# Altium schematic sheet Sheet1.SchDoc
size A3; SheetNumber: 1; SheetTotal: 1
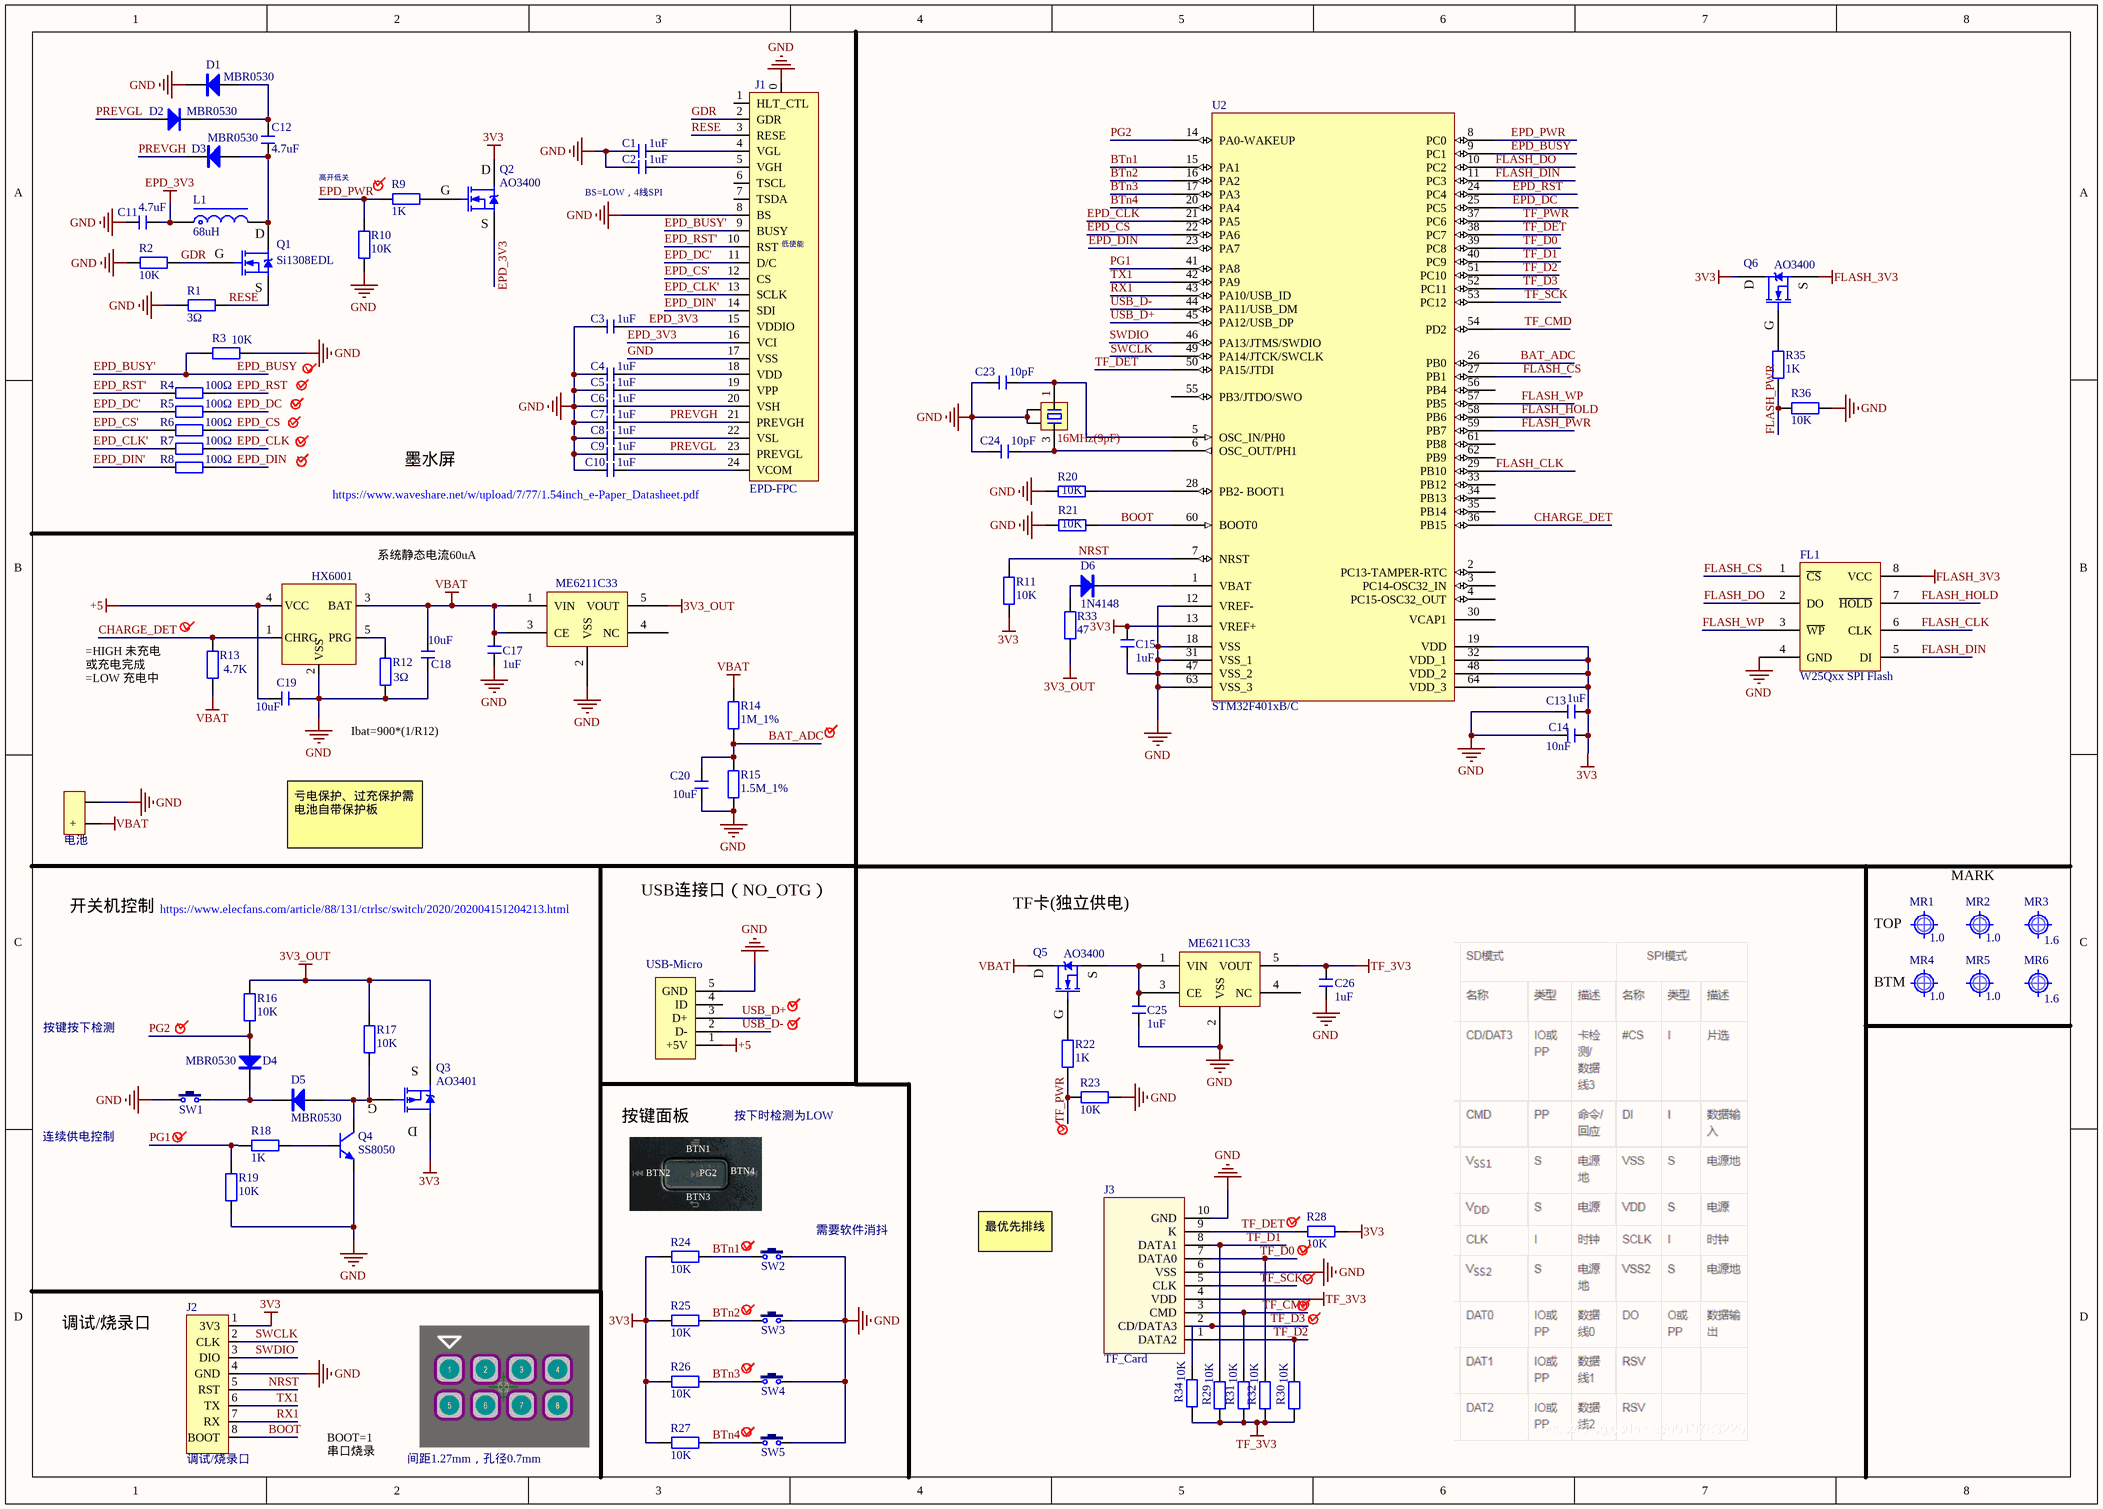
[diagram p0: Sheet1.SchDoc]

## Parts
BAT  电池  [BAT_AC]
C1  1uF  [0603]
C2  1uF  [0603]
C3  1uF  [0603]
C4  1uF  [0603]
C5  1uF  [0603]
C6  1uF  [0603]
C7  1uF  [0603]
C8  1uF  [0603]
C9  1uF  [0603]
C10  1uF  [0603]
C11  4.7uF  [0603]
C12  4.7uF  [0603]
C13  1uF  [0603]
C14  10nF  [0603]
C15  1uF  [0603]
C17  1uF  [0603]
C18  10uF  [0603]
C19  10uF  [0603]
C20  10uF  [0603]
C23  10pF  [0603]
C24  10pF  [0603]
C25  1uF  [0603]
C26  1uF  [0603]
CC1  HX6001  [SOT23-5]
D1  MBR0530  [SOD-123]
D2  MBR0530  [SOD-123]
D3  MBR0530  [SOD-123]
D4  MBR0530  [SOD-123]
D5  MBR0530  [SOD-123]
D6  1N4148  [SOD-123]
FL1  W25Qxx SPI Flash  [SOP8_N]
J1  EPD-FPC  [FPC0.5 2H-WS-24P]
J2  调试/烧录口  [DEBUG_JP]
J3  TF_Card  [Micro SD]
L1  68uH  [0805]
MR1  1.0  [Mark 1]
MR2  1.0  [Mark 1]
MR3  1.6  [Mark 1.6]
MR4  1.0  [Mark 1]
MR5  1.0  [Mark 1]
MR6  1.6  [Mark 1.6]
PD1  ME6211C33  [SOT23-5]
PD2  ME6211C33  [SOT23-5]
Q1  Si1308EDL  [SOT323]
Q2  AO3400  [SOT23]
Q3  AO3401  [SOT23]
Q4  SS8050  [SOT23]
Q5  AO3400  [SOT23]
Q6  AO3400  [SOT23]
R1  3Ω  [0603]
R2  10K  [0603]
R3  10K  [0603]
R4  100Ω  [0603]
R5  100Ω  [0603]
R6  100Ω  [0603]
R7  100Ω  [0603]
R8  100Ω  [0603]
R9  1K  [0603]
R10  10K  [0603]
R11  10K  [0603]
R12  3Ω  [0603]
R13  4.7K  [0603]
R14  1M_1%  [0603]
R15  1.5M_1%  [0603]
R16  10K  [0603]
R17  10K  [0603]
R18  1K  [0603]
R19  10K  [0603]
R20  10K  [0603]
R21  10K  [0603]
R22  1K  [0603]
R23  10K  [0603]
R24  10K  [0603]
R25  10K  [0603]
R26  10K  [0603]
R27  10K  [0603]
R28  10K  [0603]
R29  10K  [0603]
R30  10K  [0603]
R31  10K  [0603]
R32  10K  [0603]
R33  47  [0603]
R34  10K  [0603]
R35  1K  [0603]
R36  10K  [0603]
SW1  3x6x5  [TSW SMD-3*6*2.5]  (value not drawn)
SW2  3x6x5  [TSW SMD-3*6*2.5]  (value not drawn)
SW3  3x6x5  [TSW SMD-3*6*2.5]  (value not drawn)
SW4  3x6x5  [TSW SMD-3*6*2.5]  (value not drawn)
SW5  3x6x5  [TSW SMD-3*6*2.5]  (value not drawn)
U2  STM32F401xB/C  [LQFP64 10x10_N]
USB-Micro  无柱贴片  [USB-MICRO_E]  (value not drawn)
X?  16MHz(9pF)  [OSC 3225-4P]

## Nets
3V3: C13.2 C14.2 C15.1 J2.1(3V3) Q2.2(D) Q3.2(D) Q6.2(D) R11.2 R24.1 R25.1 R26.1 R27.1 R28.1 U2.13(VREF+) U2.19(VDD) U2.32(VDD_1) U2.48(VDD_2) U2.64(VDD_3)
3V3_OUT: PD1.5(VOUT) Q3.3(S) R16.1 R17.2 R33.2
+5: C19.1 CC1.4(VCC) USB-Micro.1(+5V)
EPD_3V3: C3.2 C11.2 J1.15(VDDIO) J1.16(VCI) L1.1 Q2.3(S)
FLASH_3V3: FL1.8(VCC) Q6.3(S)
GND: BAT.2(-) C1.1 C2.1 C3.1 C4.1 C5.1 C6.1 C7.1 C8.1 C9.1 C10.1 C11.1 C13.1 C14.1 C15.2 C17.2 C18.1 C19.2 C20.1 C23.2 C24.2 C25.1 C26.1 CC1.2(VSS) D1.2(K) FL1.4(GND) J1.0 J1.8(BS) J1.17(VSS) J2.4(GND) J3.6(VSS) J3.10(GND) PD1.2(VSS) PD2.2(VSS) Q4.3(E) R1.1 R2.1 R3.2 R10.2 R12.1 R15.2 R19.2 R20.2 R21.1 R23.2 R36.2 SW1.1 SW2.2 SW3.2 SW4.2 SW5.2 U2.12(VREF-) U2.18(VSS) U2.31(VSS_1) U2.47(VSS_2) U2.63(VSS_3) USB-Micro.5(GND) X?.2 X?.4
TF_3V3: C26.2 J3.4(VDD) PD2.5(VOUT) R29.1 R30.1 R31.1 R32.1 R34.1
VBAT: BAT.1(+) C17.1 C18.2 CC1.3(BAT) PD1.1(VIN) PD1.3(CE) Q5.2(D) R13.2 R14.1
BAT_ADC: C20.2 R14.2 R15.1 U2.26(PB0)
BOOT: J2.8(BOOT) R21.2 U2.60(BOOT0)
BTn1: R24.2 SW2.1 U2.15(PA1)
BTn2: R25.2 SW3.1 U2.16(PA2)
BTn3: R26.2 SW4.1 U2.17(PA3)
BTn4: R27.2 SW5.1 U2.20(PA4)
CHARGE_DET: CC1.1(CHRG) R13.1 U2.36(PB15)
EPD_BUSY: J1.9(BUSY) R3.1 U2.9(PC1)  [also labelled EPD_BUSY']
EPD_CLK: R7.2 U2.21(PA5)
EPD_CLK': J1.13(SCLK) R7.1
EPD_CS: R6.2 U2.22(PA6)
EPD_CS': J1.12(CS) R6.1
EPD_DC: R5.2 U2.25(PC5)
EPD_DC': J1.11(D/C) R5.1
EPD_DIN: R8.2 U2.23(PA7)
EPD_DIN': J1.14(SDI) R8.1
EPD_PWR: R9.1 R10.1 U2.8(PC0)
EPD_RST: R4.2 U2.24(PC4)
EPD_RST': J1.10(RST) R4.1
FLASH_CLK: FL1.6(CLK) U2.29(PB10)
FLASH_CS: FL1.1(~{CS}) U2.27(PB1)
FLASH_DIN: FL1.5(DI) U2.11(PC3)
FLASH_DO: FL1.2(DO) U2.10(PC2)
FLASH_HOLD: FL1.7(~{HOLD}) U2.58(PB6)
FLASH_PWR: R35.1 R36.1 U2.59(PB7)
FLASH_WP: FL1.3(~{WP}) U2.57(PB5)
GDR: J1.2(GDR) Q1.2(G) R2.2
NRST: J2.5(RST) R11.1 U2.7(NRST)
PG1: R18.1 R19.1 U2.41(PA8)
PG2: D4.1(A) R16.2 U2.14(PA0-WAKEUP)
PREVGH: C7.2 D3.2(K) J1.21(PREVGH)
PREVGL: C9.2 D2.1(A) J1.23(PREVGL)
RESE: J1.3(RESE) Q1.1(S) R1.2
RX1: J2.7(RX) U2.43(PA10/USB_ID)
SWCLK: J2.2(CLK) U2.49(PA14/JTCK/SWCLK)
SWDIO: J2.3(DIO) U2.46(PA13/JTMS/SWDIO)
TF_CMD: J3.3(CMD) R31.2 U2.54(PD2)
TF_D0: J3.7(DATA0) R32.2 U2.39(PC8)
TF_D1: J3.8(DATA1) R29.2 U2.40(PC9)
TF_D2: J3.1(DATA2) R30.2 U2.51(PC10)
TF_D3: J3.2(CD/DATA3) R34.2 U2.52(PC11)
TF_DET: J3.9(K) R28.2 U2.38(PC7) U2.50(PA15/JTDI)
TF_PWR: R22.1 R23.1 U2.37(PC6)
TF_SCK: J3.5(CLK) U2.53(PC12)
TX1: J2.6(TX) U2.42(PA9)
USB_D+: U2.45(PA12/USB_DP) USB-Micro.3(D+)
USB_D-: U2.44(PA11/USB_DM) USB-Micro.2(D-)
NetC1_2: C1.2 J1.4(VGL)
NetC2_2: C2.2 J1.5(VGH)
NetC4_2: C4.2 J1.18(VDD)
NetC5_2: C5.2 J1.19(VPP)
NetC6_2: C6.2 J1.20(VSH)
NetC8_2: C8.2 J1.22(VSL)
NetC10_2: C10.2 J1.24(VCOM)
NetC12_1: C12.1 D3.1(A) L1.2 Q1.3(D)
NetC12_2: C12.2 D1.1(A) D2.2(K)
NetC23_1: C23.1 U2.5(OSC_IN/PH0) X?.1
NetC24_1: C24.1 U2.6(OSC_OUT/PH1) X?.3
NetC25_2: C25.2 PD2.1(VIN) PD2.3(CE) Q5.3(S)
NetCC1_5: CC1.5(PRG) R12.2
NetD4_2: D4.2(K) D5.2(K) SW1.2
NetD5_1: D5.1(A) Q3.1(G) Q4.2(C) R17.1
NetD6_1: D6.1(A) R33.1
NetD6_2: D6.2(K) U2.1(VBAT)
NetQ2_1: Q2.1(G) R9.2
NetQ4_1: Q4.1(B) R18.2
NetQ5_1: Q5.1(G) R22.2
NetQ6_1: Q6.1(G) R35.2
NetR20_1: R20.1 U2.28(PB2-_BOOT1)

Not connected (* = marked no-connect by the designer): J1 1(HLT_CTL) 6(TSCL) 7(TSDA); PD1 4(NC); PD2 4(NC); U2 2(PC13-TAMPER-RTC) 3(PC14-OSC32_IN) 4(PC15-OSC32_OUT) 30(VCAP1) 33(PB12) 34(PB13) 35(PB14) 55(PB3/JTDO/SWO) 56(PB4) 61(PB8) 62(PB9); USB-Micro 4(ID)

## Notes on the sheet
- 高开低关
- (near C2) BS=LOW，4线SPI
- (near J1) 低使能
- https://www.waveshare.net/w/upload/7/77/1.54inch_e-Paper_Datasheet.pdf
- 墨水屏
- (near CC1) 系统静态电流60uA
- Ibat=900*(1/R12)
- 亏电保护、过充保护需电池自带保护板
- 开关机控制
- https://www.elecfans.com/article/88/131/ctrlsc/switch/2020/202004151204213.html
- USB连接口（NO_OTG）
- (near Q5) TF卡(独立供电)
- MARK
- (near MR1) TOP
- (near MR4) BTM
- 按键按下检测
- 按键面板
- 按下时检测为LOW
- 连续供电控制
- BTN2
- BTN1
- PG2
- BTN4
- BTN3
- (near SW2) 需要软件消抖
- 最优先排线
- 调试/烧录口
- BOOT=1
  串口烧录
- 间距1.27mm，孔径0.7mm

## Library data of the parts
BAT = J_BAT: 电池接口
C1 = C: 无极性贴片电容 50v耐压; 版权归属: 源创客; BOM名称: 无极性贴片电容; 学习资源: www.ooocke.com
C2-C15 C17-C20 C23-C26 = C: 无极性贴片电容; 版权归属: 源创客; BOM名称: 无极性贴片电容; 学习资源: www.ooocke.com
CC1 = HX6001: HX6001(UN8HX)锂电池充电管理IC
D1-D5 = MBR0530: 肖特基二极管; BOM名称: 整流二极管; 版权归属: 源创客; 学习资源: www.ooocke.com
D6 = 1N4148: 开关二极管; BOM名称: 肖特基二极管; 版权归属: 源创客; 属性: 40V/3A; 学习资源: www.ooocke.com
FL1 = W25Qxx: W25Qxx SPI Flash,容量小于128Mbit
J2 = DEBUG_JP
J3 = TF_Card: TF卡座; 版权归属: 源创客; BOM名称: TF卡座; 学习资源: www.ooocke.com
L1 = L-CD: 贴片功率电感; BOM名称: 功率电感; 版权归属: 源创客; 学习资源: www.ooocke.com
MR1-MR6 = MARK: 光学定位点; 版权归属: 源创客; BOM名称: 光学定位点; 学习资源: www.ooocke.com
PD1 PD2 = ME6211C33: ME6211C33 3.3v线性LDO
Q1 = Si1308EDL: N沟道场效应管; 版权归属: 源创客; BOM名称: N沟道场效应管; 学习资源: www.ooocke.com
Q2 Q5 Q6 = AO3400: N沟道场效应管; 版权归属: 源创客; BOM名称: N沟道场效应管; 学习资源: www.ooocke.com
Q3 = AO3401: P沟增强型场效应管; BOM名称: P沟场效应管; 版权归属: 源创客; 学习资源: www.ooocke.com
Q4 = 8050: 高频放大三极管-NPN型; BOM名称: 高频放大-NPN型; 版权归属: 源创客; 属性: 40V 1.5A 1W 100MHZ; 学习资源: www.ooocke.com
R1-R36 = R: 贴片电阻; 版权归属: 源创客; BOM名称: 贴片电阻; 学习资源: www.ooocke.com
SW1-SW5 = TSW 3x6: 3x6轻触开关; 版权归属: 源创客; BOM名称: 3x6轻触开关; 学习资源: www.ooocke.com
U2 = STM32F401xB/C: STM32F401xB/C 64pin
USB-Micro = USB-5P: 微型USB母座; 版权归属: 源创客; BOM名称: 微型USB母座; 学习资源: www.ooocke.com
X? = XTAL-4P: 4脚无源晶振; 版权归属: 源创客; BOM名称: 4脚无源晶振; 学习资源: www.ooocke.com